# EAGLE board MOD-v2-2.1 (EAGLE 8.3.1)
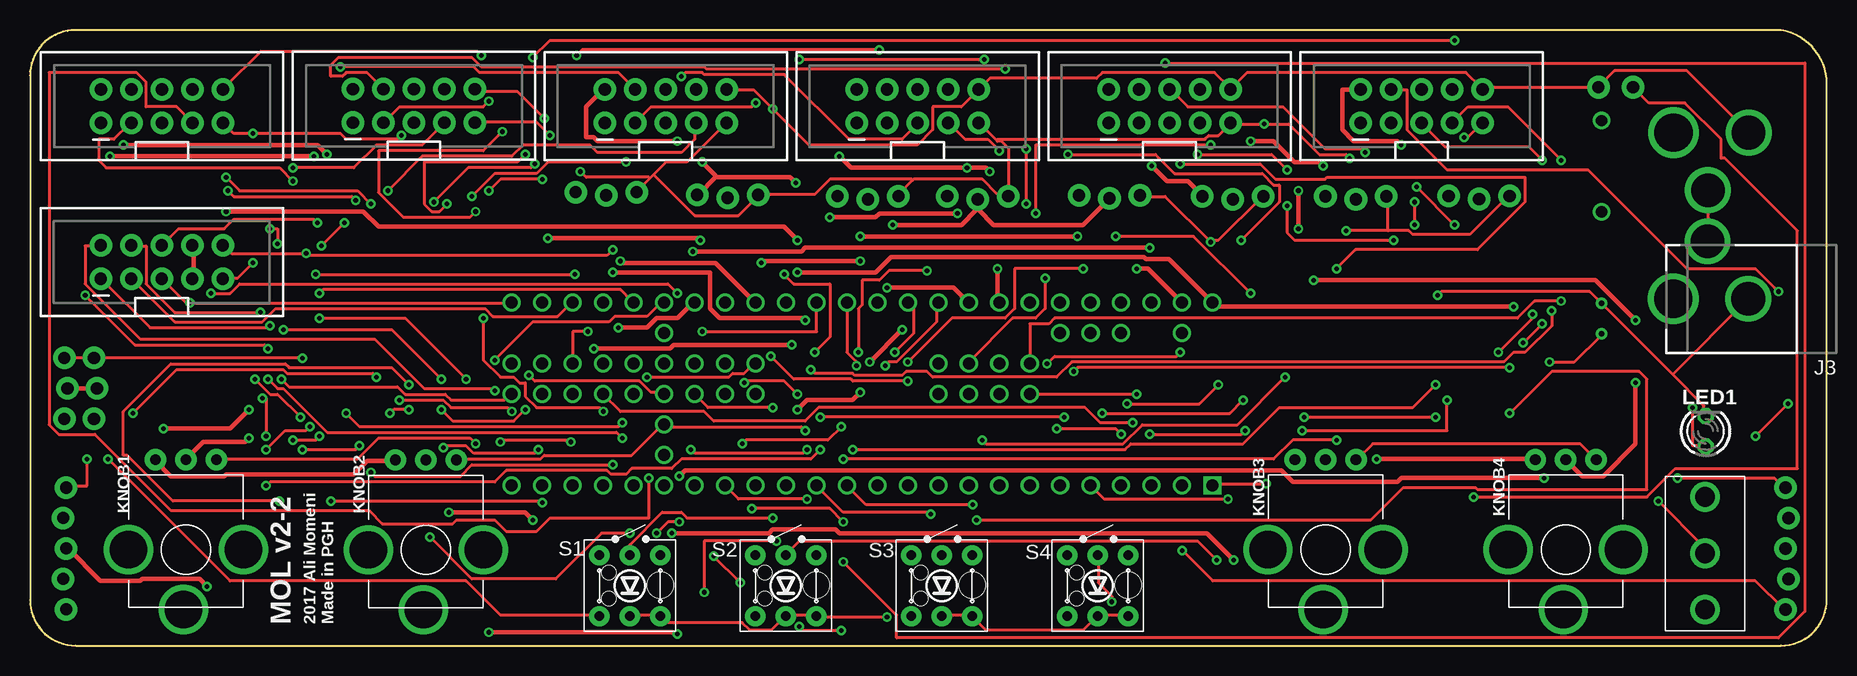
[diagram p2: board, top side]
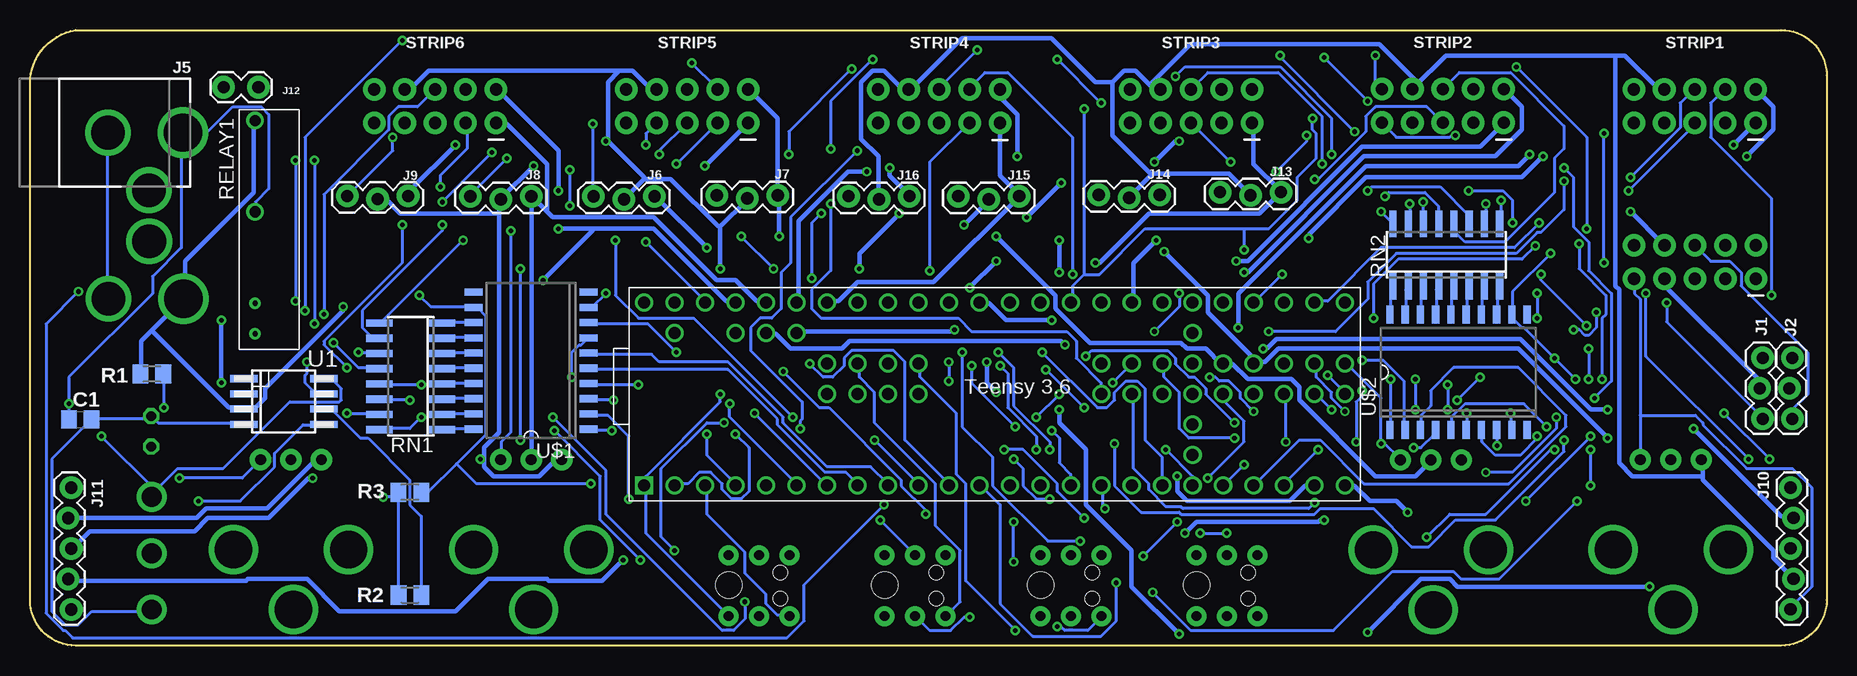
[diagram p3: board, bottom side, seen from below]

Size 149.77 x 51.34 mm. Coordinates in mm from the lower left corner, seen from the top.
Outline: 3.81,51.34 arc90 0,47.53 0,3.81 arc90 3.81,0 145.96,0 arc90 149.77,3.81 149.77,47.26 arc74 145.96,51.34 3.81,51.34
Copper layers (1*16): Top 0.035559375mm / dielectric 1.501140625mm / Bottom 0.035559375mm
Design rules "typical_4pcb *": minimum track width 10mil, minimum drill 15mil, track to track 6mil, track to pad 6mil, pad to pad 6mil, via to via 10mil, smd to smd 6mil, copper to edge 15mil, drill to drill 8mil, minimum pad ring 10mil, minimum via ring 8mil, stop-mask expansion 4mil, vias tented up to drill 0mil, thermal gap 10mil
Net classes: 2 Power: width 0.381 mm, clearance 0.279 mm; 3 Analog Sig: width 0.381 mm, clearance 0.279 mm

## Footprints (pad centres in the part's own frame; a part is rotated, then mirrored left to right if it is on the bottom)
C0805 = smd 1.3 x 1.5: 1 -0.95,0; 2 0.95,0
1X03_LOCK@1 = drill 1.016 pad 1.88: 1 0,0.127; 2 2.54,-0.127; 3 5.08,0.127
DCJACK_2MM_PTH = drill 2.8: GND 0,7.35; GNDBREAK 4.8,10.75 | drill 3.2: PWR 0,13.6
2X5-SHROUDED_LOCK = drill 1.016 pad 1.88: 1 -1.397,5.08; 2 1.397,5.08; 3 -1.397,2.54; 4 1.397,2.54; 5 -1.397,0; 6 1.397,0; 7 -1.397,-2.54; 8 1.397,-2.54; 9 -1.397,-5.08; 10 1.397,-5.08
1X03_LOCK = drill 1.016 pad 1.88: 1 0,0.127; 2 2.54,-0.127; 3 5.08,0.127
1X05_LOCK = drill 1.016 pad 1.88: 1 0,0.127; 2 2.54,-0.127; 3 5.08,0.127; 4 7.62,-0.127; 5 10.16,0.127
1X02_LOCK = drill 1.016 pad 1.88: 1 -0.178,0; 2 2.718,0
TRIM-PCB-9MM = drill 0.9 pad 1.778: 1 -2.54,-7.5; 2 0,-7.5; 3 2.54,-7.5 | drill 3.1 pad 4: M1 -4.8,0; M2 4.8,0; M3 0.2,5
LED3MM = drill 0.813 octagon: A -1.27,0; K 1.27,0
M0805 = smd 1.3 x 1.6: 1 -0.95,0; 2 0.95,0
G6DN-1A = drill 0.45: 1 0,0; 2 2.54,0 | drill 0.95: 5 10.16,0; 8 17.78,0
SO16 = smd 0.6 x 2.2: 1 -4.445,-2.6; 2 -3.175,-2.6; 3 -1.905,-2.6; 4 -0.635,-2.6; 5 0.635,-2.6; 6 1.905,-2.6; 7 3.175,-2.6; 8 4.445,-2.6; 9 4.445,2.6; 10 3.175,2.6; 11 1.905,2.6; 12 0.635,2.6; 13 -0.635,2.6; 14 -1.905,2.6; 15 -3.175,2.6; 16 -4.445,2.6
SWITCH_TR2-MOMENTARY-LED = drill 0.8 pad 1.676: 1 2.54,-2.54; 2 2.54,2.54; 3 -2.54,-2.54; 4 -2.54,2.54; A 0,2.54; C 0,-2.54 | hole 2.2: 2.53,0.05 | hole 1.2: -1.76,1.1; -1.76,-1.09
SWITCH_SPDT_500SSP1S2M2QEA = drill 1.65: 1 -4.7,0; 2 0,0; 3 4.7,0
TEENSY3-6_NO-USB-HOST = drill 1: 0 3.81,1.27; 1 6.35,1.27; 2 8.89,1.27; 3 11.43,1.27; 3V3(1) 36.83,1.27; 3V3(2) 46.99,6.35; 3V3(3) 6.35,16.51; 3V3(4) 59.69,11.43; 4 13.97,1.27; 5 16.51,1.27; 6 19.05,1.27; 7 21.59,1.27; 8 24.13,1.27; 9 26.67,1.27; 10 29.21,1.27; 11 31.75,1.27; 12 34.29,1.27; 13 34.29,16.51; 14 31.75,16.51; 15 29.21,16.51; 16 26.67,16.51; 17 24.13,16.51; 18 21.59,16.51; 19 19.05,16.51; 20 16.51,16.51; 21 13.97,16.51; 22 11.43,16.51; 23 8.89,16.51; 24 39.37,1.27; 25 41.91,1.27; 26 44.45,1.27; 27 46.99,1.27; 28 49.53,1.27; 29 52.07,1.27; 30 54.61,1.27; 31 57.15,1.27; 32 59.69,1.27; 33 59.69,16.51; 34 57.15,16.51; 35 54.61,16.51; 36 52.07,16.51; 37 49.53,16.51; 38 46.99,16.51; 39 44.45,16.51; 40 39.37,8.89; 41 41.91,8.89; 42 44.45,8.89; 43 49.53,8.89; 44 52.07,8.89; 45 54.61,8.89; 46 57.15,8.89; 47 57.15,11.43; 48 54.61,11.43; 49 52.07,11.43; 50 49.53,11.43; 51 44.45,11.43; 52 41.91,11.43; 53 39.37,11.43; 54 24.13,11.43; 55 21.59,11.43; 56 19.05,11.43; 57 16.51,11.43; A10 11.43,13.97; A11 13.97,13.97; AGND 3.81,16.51; AREF 8.89,13.97; DAC0 41.91,16.51; DAC1 39.37,16.51; DC 21.59,8.89; DD 24.13,8.89; DE 19.05,8.89; G1 46.99,8.89; G2 36.83,16.51; G3 59.69,8.89; G6 16.51,8.89; P 46.99,11.43; R 46.99,13.97; VBAT 46.99,3.81; VIN 1.27,16.51; VUSB 3.81,13.97 | drill 1 square: G0 1.27,1.27
ATTINY85 = smd 0.6 x 2.286: 1 -1.905,-3.33; 2 -0.635,-3.33; 3 0.635,-3.33; 4 1.905,-3.33; 5 1.905,3.33; 6 0.635,3.33; 7 -0.635,3.33; 8 -1.905,3.33
SOIC20 = smd 0.6 x 1.5: 1 -5.715,-4.8; 2 -4.445,-4.8; 3 -3.175,-4.8; 4 -1.905,-4.8; 5 -0.635,-4.8; 6 0.635,-4.8; 7 1.905,-4.8; 8 3.175,-4.8; 9 4.445,-4.8; 10 5.715,-4.8; 11 5.715,4.8; 12 4.445,4.8; 13 3.175,4.8; 14 1.905,4.8; 15 0.635,4.8; 16 -0.635,4.8; 17 -1.905,4.8; 18 -3.175,4.8; 19 -4.445,4.8; 20 -5.715,4.8

## Placement (x,y rotation side)
C1  10uF  [C0805]  145.58,18.85 0 bottom
J1  SERVO1  [1X03_LOCK@1]  5.46,23.99 270 bottom
J2  SERVO2  [1X03_LOCK@1]  2.99,23.99 270 bottom
J3  RPi  [DCJACK_2MM_PTH]  150.58,28.92 90 top
J4  ACTUATORS  [2X5-SHROUDED_LOCK]  10.99,31.99 90 top
J5  Battery  [DCJACK_2MM_PTH]  150.61,42.77 270 bottom
J6  AN5  [1X03_LOCK]  102.8,37.34 0 bottom
J7  AN6  [1X03_LOCK]  92.52,37.42 0 bottom
J8  AN7  [1X03_LOCK]  113.06,37.34 0 bottom
J9  AN8  [1X03_LOCK]  123.33,37.36 0 bottom
J10  JOY1  [1X05_LOCK]  2.89,3.02 90 bottom
J11  JOY2  [1X05_LOCK]  146.46,13.17 270 bottom
J12  RPi-Shutdown  [1X02_LOCK]  133.45,46.57 0 bottom
J13  AN5  [1X03_LOCK]  50.57,37.68 0 bottom
J14  AN6  [1X03_LOCK]  60.69,37.46 0 bottom
J15  AN7  [1X03_LOCK]  72.39,37.35 0 bottom
J16  AN8  [1X03_LOCK]  81.54,37.35 0 bottom
KNOB1  [TRIM-PCB-9MM]  13,8 180 top
KNOB2  [TRIM-PCB-9MM]  33,7.99 180 top
KNOB3  [TRIM-PCB-9MM]  107.99,8.01 180 top
KNOB4  [TRIM-PCB-9MM]  128.01,8 180 top
LED1  [LED3MM]  139.67,17.87 90 top
R1  330  [M0805]  139.62,22.65 0 bottom
R2  2.2K  [M0805]  118.09,4.21 180 bottom
R3  3.3K  [M0805]  118.1,12.79 0 bottom
RELAY1  RELAY-OMRON-G6DN  [G6DN-1A]  131,26 90 bottom
RN1  [SO16]  118.03,22.46 90 bottom
RN2  [SO16]  31.71,32.58 0 bottom
S1  SW-LEDPTH  [SWITCH_TR2-MOMENTARY-LED]  50,5 0 top
S2  SW-LEDPTH  [SWITCH_TR2-MOMENTARY-LED]  63,5 0 top
S3  SW-LEDPTH  [SWITCH_TR2-MOMENTARY-LED]  76,5 0 top
S4  SW-LEDPTH  [SWITCH_TR2-MOMENTARY-LED]  89,5 0 top
STRIP1  [2X5-SHROUDED_LOCK]  11,44.99 90 top
STRIP2  [2X5-SHROUDED_LOCK]  32,45.01 90 top
STRIP3  [2X5-SHROUDED_LOCK]  52.99,44.99 90 top
STRIP4  [2X5-SHROUDED_LOCK]  73.99,44.98 90 top
STRIP5  [2X5-SHROUDED_LOCK]  94.99,44.99 90 top
STRIP6  [2X5-SHROUDED_LOCK]  116,44.99 90 top
SW2  500SSP1S2M2QEA  [SWITCH_SPDT_500SSP1S2M2QEA]  139.62,7.7 270 top
TEENSY  TEENSY3_6-ALI_NO-USB-HOST  [TEENSY3-6_NO-USB-HOST]  99.84,12.09 0 bottom
U1  ATTINY85  [ATTINY85]  128.61,20.36 270 bottom
U$1  A2982  [SOIC20]  108,23.76 90 bottom
U$2  A2982  [SOIC20]  30.7,22.8 0 bottom

## Tracks (layer width: path | path; a pad name or v marks a point on that pad's centre or on a via)
+3V3  (via drill 0.38)
  Top 0.254: KNOB2.1 35.56,15.56 42.55,15.56 42.86,15.88 50.16,15.88 52.7,18.41 TEENSY.3V3(2) 52.7,18.26 64.29,18.26 v64.61,17.94 | v30.96,42.55 30.64,42.23 26.35,42.23 25.88,42.7 v18.57,42.7 16.99,42.7 16.19,43.5 STRIP1.9 | v18.57,31.91 17.3,30.64 16.19,30.64 J4.9 | v37.15,16.83 36.67,17.3 29.05,17.3 27.3,15.56 15.56,15.56 KNOB1.1 | KNOB3.1 110.65,15.56 111.92,16.83 129.22,16.83 130.49,15.56 KNOB4.1 | v137.32,13.97 145.41,13.97 146.21,13.18 J11.1 | J7.1 92.55,37.47 94.61,37.47 v98.42,33.66 98.42,33.81 99.06,33.81 102.71,37.47 J6.1 | 113.19,34.61 113.19,37.47 J8.1 | 113.19,34.61 114.94,34.61 115.25,34.29 120.02,34.29 123.19,37.47 J9.1 | v119.54,42.39 119.86,42.39 120.97,43.5 STRIP6.9 | 51.99,39.29 53.02,40.32 54.77,40.32 57.94,43.5 STRIP3.9 | 51.99,39.29 51.67,38.97 | 51.67,38.97 50.64,37.94 J13.1 | 51.99,39.29 55.4,35.88 59.05,35.88 60.64,37.47 J14.1 60.8,37.62 65.41,37.62 66.67,38.89 73.5,38.89 73.58,38.81 | 73.58,38.81 73.66,38.89 79.38,38.89 80.64,37.62 81.44,37.62 J16.1 81.6,37.62 81.6,41.43 80.96,42.07 80.64,42.07 80.57,42.15 | 73.58,38.81 72.39,37.62 J15.1 | 80.57,42.15 79.22,43.5 STRIP4.9 | 80.57,42.15 80.64,42.23 97.95,42.23 98.27,42.55 99.06,42.55 100.01,43.5 STRIP5.9 100.17,43.5 v102.87,43.5 104.93,43.5 107.47,40.96 109.7,40.96 v110.01,40.64 | 113.19,34.61 v109.7,34.61 | v43.34,42.55 42.23,43.66 37.15,43.66 STRIP2.9 | v45.88,39.53 46.35,39.05 51.59,39.05 51.67,38.97
  Bottom 0.254: 36.91,16.91 35.56,15.56 KNOB2.1 | 36.91,16.91 37.15,17.14 37.15,20.64 40.01,23.5 TEENSY.3V3(4) | v64.61,17.94 63.98,17.3 63.98,15.24 63.02,14.29 63.02,13.49 TEENSY.3V3(1) | v30.96,42.55 31.27,42.55 31.43,42.39 35.88,42.39 36.99,43.5 STRIP2.9 | 15.56,19.21 15.56,28.89 16.03,29.37 16.03,30.48 J4.9 | 15.56,19.21 15.56,15.56 KNOB1.1 | 15.56,19.21 10.95,19.21 10.32,18.57 10.32,18.41 6.67,14.76 2.86,14.76 1.27,13.18 1.27,4.92 3.02,3.17 J10.1 | v18.57,31.91 v18.57,42.7 | v37.15,16.83 36.99,16.83 36.91,16.91 | v137.32,13.97 132.08,13.97 130.65,15.4 KNOB4.1 | v98.42,33.66 93.5,28.73 TEENSY.3V3(3) | v119.54,42.39 119.54,41.27 123.19,37.62 J9.1 | v110.01,40.64 113.03,37.62 J8.1 | v102.87,43.5 102.87,37.62 J6.1 | v109.7,34.61 109.7,17.78 110.49,16.99 110.49,15.56 KNOB3.1 | v43.34,42.55 43.34,42.07 v45.88,39.53
+5V  (via drill 0.38)
  Top 0.381: J2.2 3.17,21.43 5.56,21.43 J1.2 | J4.7 13.65,30.64 13.65,33.34 J4.8 | v123.67,28.26 98.9,28.26 98.58,28.57 TEENSY.VIN 98.42,28.73 94.93,32.23 93.03,32.23 92.87,32.38 71.75,32.38 70.48,31.11 v63.98,31.11 | v16.35,36.2 27.78,36.2 29.05,34.92 62.87,34.92 v63.98,33.81
  Bottom 0.381: J1.2 5.71,21.59 5.71,22.23 13.49,30 13.49,30.48 J4.7 | 139.62,26.27 137,28.89 J3.PWR 136.84,29.05 136.84,32.07 131.13,37.78 131.13,43.66 RELAY1.8 | 139.62,26.27 140.49,25.4 140.49,22.7 R1.1 | 139.62,26.27 133.19,19.84 132.08,19.84 U1.3 131.76,19.68 131.13,19.68 130.18,20.64 130.18,21.43 123.67,27.94 v123.67,28.26 | v16.35,36.2 13.65,33.5 J4.8 | v63.98,31.11 v63.98,33.81
+5V-BATTERY  (via drill 0.38)
  Top 0.254: v146.53,20.16 v143.83,17.46
  Bottom 0.254: U1.8 125.25,22.23 124.62,22.23 123.83,21.43 123.83,20.48 123.98,20.32 128.11,20.32 133.67,14.76 137.48,14.76 139.7,12.54 SW2.1 139.38,13.02 v143.83,17.46 | 137.16,40.64 137.16,42.7 J5.PWR | 137.16,40.64 137.16,33.18 139.54,30.8 139.54,29.37 146.53,22.38 v146.53,20.16 146.53,18.89 C1.1 | 137.16,40.64 132.87,44.93 130.49,44.93 129.86,44.29 129.86,38.1 130.97,36.99 130.97,36.2 RELAY1.5
AGND  (via drill 0.38)
  Top 0.381: v112.24,15.56 125.41,15.56 KNOB4.3 | KNOB2.3 30.32,15.4 28.1,15.4 26.99,14.29 16.35,14.29 16.19,14.13 11.75,14.13 10.48,15.4 KNOB1.3 | v71.91,35.08 77.63,35.08 78.9,36.35 78.9,37.15 J16.2 79.06,36.35 80.33,35.08 87.79,35.08 89.85,37.15 J7.2 | v92.23,31.43 93.19,31.43 95.89,28.73 TEENSY.AGND | v107.79,40.01 107.47,40.32 105.41,40.32 103.66,42.07 v101.76,42.07
  Bottom 0.381: KNOB4.3 125.57,15.4 126.05,15.4 130.02,11.43 135.1,11.43 135.89,10.64 146.53,10.64 J11.2 | 111.92,15.56 111.92,16.51 110.65,17.78 110.65,36.04 | 111.92,15.56 111.92,14.92 111.12,14.13 107.31,14.13 106.05,15.4 105.57,15.4 KNOB3.3 | 110.65,36.04 110.65,37.15 J8.2 110.49,37.31 v107.79,40.01 | 110.65,36.04 118.9,36.04 120.02,37.15 120.65,37.15 J9.2 | v112.24,15.56 111.92,15.56 | 10.32,14.13 10.32,13.81 4.45,7.94 4.45,7.3 2.86,5.71 J10.2 | 10.32,14.13 10.32,15.4 KNOB1.3 | 17.62,49.21 31.75,49.21 34.45,46.51 STRIP2.8 34.13,46.99 37.31,50.16 53.02,50.16 56.36,46.83 STRIP3.8 55.56,46.51 56.2,46.51 57.63,47.94 58.58,47.94 59.53,46.99 | 17.62,49.21 16.83,49.21 14.13,46.51 13.65,46.51 STRIP1.8 | 56.2,39.37 49.85,39.37 48.1,37.62 J13.2 | 56.2,39.37 58.1,37.47 J14.2 | 59.53,46.99 59.53,42.55 56.36,39.37 56.2,39.37 | v71.91,35.08 69.85,37.15 J15.2 | J16.2 79.06,37.31 79.06,40.8 80.49,42.23 80.49,46.99 79.53,47.94 78.58,47.94 77.15,46.51 76.68,46.51 STRIP4.8 76.36,46.35 72.07,50.64 64.61,50.64 60.96,46.99 59.53,46.99 | 92.23,34.92 v92.23,31.43 | 92.23,34.92 90.01,37.15 J7.2 | 98.58,38.89 100.17,37.31 J6.2 | 98.58,38.89 96.36,38.89 92.39,34.92 92.23,34.92 | 100.65,47.94 99.54,47.94 98.11,46.51 97.63,46.51 STRIP5.8 | 100.65,47.94 101.6,46.99 101.6,42.07 | 101.6,42.07 98.58,39.05 98.58,38.89 | 100.65,47.94 116.52,47.94 117.95,46.51 118.43,46.51 STRIP6.8 | 10.32,14.13 16.19,14.13 17.3,15.24 17.3,29.69 17.62,30 17.62,49.21 | v101.76,42.07 101.6,42.07
AN1  (via drill 0.38)
  Top 0.381: v49.05,26.51 51.44,26.51 52.23,27.3 53.98,27.3 55.24,28.57 TEENSY.39 | v24.77,40.96 23.97,41.75 v7.78,41.75
  Bottom 0.381: v49.05,26.51 49.05,29.37 38.42,40.01 25.72,40.01 v24.77,40.96 | v7.78,41.75 6.03,43.5 STRIP1.1
AN2  (via drill 0.38)
  Top 0.381: v55.88,33.81 55.72,33.97 v43.18,33.97 | v6.67,40.8 v23.65,40.8
  Bottom 0.381: v55.88,33.81 57.78,31.91 57.78,28.73 TEENSY.DAC0 | v43.18,33.97 43.18,34.29 38.42,39.05 25.4,39.05 v23.65,40.8 | v6.67,40.8 4.45,43.02 4.45,44.93 5.87,46.35 STRIP1.2
AN3  (via drill 0.38)
  Top 0.381: v49.21,32.07 49.37,31.91 57.15,31.91 60.33,28.73 TEENSY.DAC1
  Bottom 0.381: v49.21,32.07 48.26,32.07 38.73,41.59 28.89,41.59 26.99,43.5 STRIP2.1
AN4  (via drill 0.38)
  Top 0.381: v64.61,27.15 64.45,27.3 57.47,27.3 56.67,28.1 56.67,31.11 v48.58,31.11
  Bottom 0.381: v64.61,27.15 68.42,27.15 69.85,28.57 70.48,28.57 TEENSY.15 | v48.58,31.11 48.26,31.11 38.58,40.8 27.62,40.8 25.4,43.02 25.4,44.93 26.83,46.35 STRIP2.2
AN5  (via drill 0.38)
  Top 0.381: v71.44,29.84 76.99,29.84 78.11,28.73 TEENSY.18 | v69.22,32.07 61.12,32.07 v60.96,31.91
  Bottom 0.381: v69.22,32.07 v71.44,29.84 | v60.96,31.91 60.64,31.91 56.52,36.04 47.31,36.04 45.56,37.78 J13.3 45.56,37.94 47.78,40.16 47.78,43.5 STRIP3.1
AN6  (via drill 0.38)
  Top 0.381: v80.64,31.43 80.64,28.73 TEENSY.19 | v77.31,36.04 70.8,36.04 70.48,35.72 v66.67,35.72 | v63.82,38.58 63.34,39.05 57.15,39.05 | 57.15,39.05 55.72,37.62 J14.3 | v53.98,42.07 47.31,42.07 46.99,42.39 46.35,42.39 46.35,44.93 47.78,46.35 STRIP3.2 | v56.04,40.32 57.15,39.21 57.15,39.05
  Bottom 0.381: v80.64,31.43 80.64,32.7 v77.31,36.04 | v63.82,38.58 v66.67,35.72 | v53.98,42.07 54.29,42.07 v56.04,40.32
AN7
  Bottom 0.381: TEENSY.20 83.19,28.73 82.39,28.73 80.8,30.32 74.45,30.32 67.31,37.47 J15.3 67.31,37.62 68.9,39.21 68.9,43.5 STRIP4.1
AN8  (via drill 0.38)
  Top 0.381: v80.01,39.53 79.69,39.85 v78.11,39.85 68.42,39.85 v67.47,40.8
  Bottom 0.381: v80.01,39.53 81.6,39.53 85.72,35.4 85.72,28.73 TEENSY.21 | v78.11,39.85 78.11,39.21 76.52,37.62 J16.3 | v67.47,40.8 67.47,44.29 68.9,45.72 68.9,46.35 STRIP4.2
AN9  (via drill 0.38)
  Top 0.381: v93.5,40.01 94.77,38.73 96.52,38.73 97.63,37.62 J6.3 | v18.26,17.3 17.94,16.99 14.45,16.99 13.02,15.56 KNOB1.2 | v93.34,33.18 64.61,33.18 64.29,32.86 v55.24,32.86
  Bottom 0.381: v93.5,40.01 90.01,43.5 STRIP5.1 | v18.26,17.3 25.72,24.77 45.72,24.77 46.83,23.65 47.62,23.65 TEENSY.49 47.62,23.81 51.59,27.78 51.59,29.21 v55.24,32.86 | v93.34,33.18 97.63,37.47 J6.3
AN10  (via drill 0.38)
  Top 0.381: v69.22,34.13 v87.31,34.13
  Bottom 0.381: STRIP5.2 89.85,46.35 87.47,43.97 87.47,37.62 J7.3 87.31,37.47 v87.31,34.13 | KNOB2.2 33.02,15.4 34.29,14.13 37.62,14.13 43.97,20.48 43.97,21.59 44.61,22.23 48.26,22.23 49.53,23.5 50.16,23.5 TEENSY.50 50.48,23.5 51.75,24.77 53.34,24.77 53.82,25.24 61.44,25.24 64.29,28.1 64.29,29.21 v69.22,34.13
AN11
  Bottom 0.381: 106.76,36.27 107.95,37.47 J8.3 107.95,37.31 107.95,15.56 KNOB3.2 | 106.76,36.27 106.2,35.72 97.79,35.72 92.55,30.48 90.96,30.48 89.22,28.73 88.42,28.73 TEENSY.22 | STRIP6.1 110.81,43.5 110.01,43.5 106.68,40.16 106.68,36.35 106.76,36.27
AN12  (via drill 0.38)
  Top 0.381: v105.73,37.94 v105.73,34.77 | v133.83,21.91 133.83,16.83 131.13,14.13 129.38,14.13 128.11,15.4 KNOB4.2 | v133.83,27.15 130.49,30.48 v107,30.48 | v114.3,41.75 113.98,42.07 110.33,42.07 109.38,43.02 109.38,46.35 110.81,46.35 STRIP6.2
  Bottom 0.381: v105.73,34.77 102.87,34.77 | 102.87,34.77 97.79,34.77 91.76,28.73 90.96,28.73 TEENSY.23 | v105.73,37.94 105.73,41.27 110.81,46.35 STRIP6.2 | v133.83,27.15 v133.83,21.91 | v107,30.48 102.87,34.61 102.87,34.77 | v114.3,41.75 118.11,37.94 118.11,37.62 J9.3
B1  (via drill 0.38)
  Top 0.254: v46.51,26.19 45.24,26.19 45.24,23.65 TEENSY.48 | v21.91,38.73 20.8,39.85 6.35,39.85 5.71,40.48 5.71,42.23 6.99,42.23 8.26,43.5 8.41,43.5 STRIP1.3
  Bottom 0.254: v46.51,26.19 40.96,26.19 38.26,28.89 38.26,30.32 35.88,32.7 25.88,32.7 24.13,34.45 23.81,34.45 21.91,36.35 v21.91,38.73
B2  (via drill 0.38)
  Top 0.254: v49.37,17.3 48.9,17.78 24.77,17.78 21.11,21.43 20.64,21.43 v19.84,22.23 | v19.84,24.77 19.53,25.08 8.73,25.08 v4.6,29.21
  Bottom 0.254: v49.37,17.3 53.18,17.3 53.98,18.1 53.98,21.11 55.24,22.38 55.24,23.5 TEENSY.51 | v19.84,24.77 v19.84,22.23 | v4.6,29.21 4.6,37.31 9.68,42.39 9.68,45.24 8.57,46.35 STRIP1.4
B3  (via drill 0.38)
  Top 0.254: v61.91,19.84 56.52,19.84 55.4,20.95 TEENSY.42 | v65.09,23.02 65.41,22.7 68.58,22.7 68.74,22.54 72.71,22.54 73.03,22.86 74.77,22.86 75.25,22.38 85.57,22.38 86.84,23.65 122.87,23.65 123.67,24.45 124.62,24.45 126.84,26.67 v126.84,27.94 | v118.75,50.48 43.34,50.48 v41.91,49.05 | v38.26,45.4 37.78,44.93 30.8,44.93 29.53,43.66 STRIP2.3
  Bottom 0.254: v65.09,23.02 v61.91,19.84 | v126.84,27.94 126.84,42.39 v118.75,50.48 | v38.26,45.4 v41.91,49.05
B4  (via drill 0.38)
  Top 0.254: v59.53,21.91 59.69,22.07 62.87,22.07 v63.98,20.95 | v86.2,19.05 v65.88,19.05 | v100.97,33.81 104.14,36.99 104.14,38.42 103.66,38.42 102.71,39.37 95.41,39.37 93.82,40.96 v86.52,40.96 | v81.28,48.1 56.36,48.1 56.2,48.26 37.62,48.26 36.83,49.05 25.72,49.05 25.08,48.42 25.08,47.47 26.04,47.47 26.35,47.78 28.1,47.78 29.37,46.51 STRIP2.4
  Bottom 0.254: v59.53,21.91 57.94,23.5 TEENSY.52 | v65.88,19.05 v63.98,20.95 | v86.2,19.05 94.46,27.3 99.06,27.3 100.97,29.21 v100.97,33.81 | v86.52,40.96 86.52,42.86 v81.28,48.1
B5  (via drill 0.38)
  Top 0.254: v83.03,41.43 v83.03,36.83 | v64.14,48.9 v79.53,48.9 | v60.48,45.24 60.17,44.93 51.75,44.93 50.48,43.66 STRIP3.3
  Bottom 0.254: v83.03,36.83 83.03,31.27 84.61,29.69 84.61,28.1 83.82,27.3 72.39,27.3 71.28,26.19 63.34,26.19 62.55,25.4 62.55,23.97 60.48,21.91 60.48,21.11 TEENSY.40 | v83.03,41.43 83.03,45.4 v79.53,48.9 | v60.48,45.24 v64.14,48.9
B6  (via drill 0.38)
  Top 0.254: v48.58,15.08 36.83,15.08 35.88,14.13 28.73,14.13 v28.42,14.45 | v22.54,19.05 20.64,20.95 20,20.95 v18.73,22.23 | v20.64,33.5 20.64,34.77 v20,34.77 | v25.88,48.26 36.99,48.26 37.47,47.78 49.05,47.78 50.32,46.51 STRIP3.4
  Bottom 0.254: v48.58,15.08 50.16,13.49 TEENSY.28 | v28.42,14.45 26.19,14.45 22.54,18.1 v22.54,19.05 | v18.73,22.23 18.73,27.3 18.41,27.62 18.41,29.21 20.64,31.43 v20.64,33.5 | v20,34.77 20,42.39 v25.88,48.26
B7  (via drill 0.38)
  Top 0.254: v55.09,16.35 55.4,16.03 64.45,16.03 v64.77,16.35 | v69.06,24.45 69.06,28.1 69.37,28.42 69.37,30.48 70.8,30.48 71.6,31.27 v74.77,31.27
  Bottom 0.254: v55.09,16.35 52.86,14.13 52.86,13.49 TEENSY.27 | v64.77,16.35 64.77,16.99 67.79,20 67.79,23.18 v69.06,24.45 | v74.77,31.27 74.77,40.32 71.6,43.5 STRIP4.3
B8  (via drill 0.38)
  Top 0.254: v65.41,24.45 66.67,25.72 66.67,30.16 63.66,30.16 v62.87,30.96
  Bottom 0.254: v65.41,24.45 60.8,19.84 60.01,19.84 59.37,20.48 59.37,21.11 58.42,22.07 57.47,22.07 56.83,21.43 56.83,17.14 55.4,15.72 55.4,13.49 TEENSY.26 | v62.87,30.96 62.87,42.39 68.26,47.78 70.17,47.78 71.44,46.51 STRIP4.4
B9  (via drill 0.38)
  Top 0.254: v64.77,12.22 59.05,12.22 57.94,13.34 TEENSY.25 | v67.79,15.56 103.66,15.56 105.25,17.14 v108.9,17.14 | v108.9,31.43 110.49,33.02 120.65,33.02 124.62,36.99 124.62,39.05 108.11,39.05 107.95,38.89 103.82,38.89 102.55,40.16 v95.89,40.16
  Bottom 0.254: v64.77,12.22 65.88,12.22 66.99,13.34 66.99,14.76 v67.79,15.56 | v108.9,31.43 v108.9,17.14 | v95.89,40.16 92.55,43.5 STRIP5.3
B10  (via drill 0.38)
  Top 0.254: v60.17,11.43 66.67,11.43 v67.79,10.32 | v67.79,6.99 72.23,2.54 72.23,0.64 145.73,0.64 147.96,2.86 147.96,48.58 v94.61,48.58
  Bottom 0.254: v60.17,11.43 60.33,11.59 60.33,13.34 TEENSY.24 | v67.79,6.99 v67.79,10.32 | v94.61,48.58 92.55,46.51 STRIP5.4
B11  (via drill 0.38)
  Top 0.254: v75.09,10.95 74.93,11.11 67.79,11.11 65.56,13.34 TEENSY.12 | v87,22.86 87.31,23.18 v123.35,23.18 | v115.57,38.26 v118.75,35.08
  Bottom 0.254: v75.09,10.95 75.09,11.27 77.15,13.34 77.15,13.81 83.19,19.84 83.98,19.84 v87,22.86 | v123.35,23.18 125.25,25.08 125.25,25.4 118.75,31.91 v118.75,35.08 | v115.57,38.26 115.57,39.21 113.35,41.43 113.35,43.5 STRIP6.3
B12  (via drill 0.38)
  Top 0.254: v78.58,11.75 69.69,11.75 68.1,13.34 TEENSY.11 | v145.73,29.53 143.83,31.43 138.11,31.43 129.86,39.69 118.11,39.69 114.78,43.02 114.78,46.35 113.51,46.35 STRIP6.4
  Bottom 0.254: v78.58,11.75 85.25,5.08 85.25,2.06 86.68,0.64 146.21,0.64 146.84,1.27 147,1.27 148.43,2.7 148.43,26.83 v145.73,29.53
B13  (via drill 0.38)
  Top 0.254: v56.04,26.19 65.56,26.19 65.56,28.57 TEENSY.13 | v53.98,29.37 53.18,30.16 17.46,30.16 16.67,29.37 v15.08,29.37 | v6.51,15.56 16.67,5.4 36.35,5.4 39.21,2.54 47.31,2.54 S1.3
  Bottom 0.254: v56.04,26.19 53.98,28.26 v53.98,29.37 | v15.08,29.37 15.08,24.13 v6.51,15.56
B14  (via drill 0.38)
  Top 0.254: v67.63,1.27 64.45,1.27 v64.14,1.59
  Bottom 0.254: v67.63,1.27 71.75,5.4 71.75,13.49 72.55,14.29 72.55,19.37 75.56,22.38 75.56,23.5 TEENSY.54 | v64.14,1.59 63.82,1.59 63.5,1.27 61.59,1.27 60.48,2.38 S2.3
B15
  Bottom 0.254: TEENSY.56 80.64,23.5 80.64,22.38 79.38,21.11 79.38,18.57 74.3,13.49 74.3,10 72.23,7.94 72.23,3.65 73.34,2.54 S3.3
B16
  Bottom 0.254: TEENSY.1 93.34,13.34 93.34,10.95 90.17,7.78 90.17,6.03 88.42,4.29 88.42,3.49 87.47,2.54 86.52,2.54 S4.3
GND  (via drill 0.38)
  Top 0.254: S1.C 50.01,2.54 52.39,2.54 S1.1 52.55,2.38 53.02,1.91 59.37,1.91 60.01,1.27 61.75,1.27 62.87,2.38 S2.C 63.02,2.54 65.41,2.54 S2.1 65.56,2.38 v71.44,2.38 | S3.C 76.04,2.54 78.42,2.54 S3.1 78.58,2.38 79.69,1.27 87.79,1.27 88.9,2.38 S4.C 89.06,2.54 91.44,2.54 S4.1 | v92.23,20.95 83.34,20.95 TEENSY.G6 | v103.03,13.49 98.58,13.49 TEENSY.G0 | v41.59,22.54 42.07,22.07 50.8,22.07 51.75,21.11 52.7,21.11 TEENSY.G1 | J2.1 3.02,23.97 5.24,23.97 J1.1 5.4,23.97 v22.7,23.97 | J4.10 16.19,33.34 16.83,32.7 v23.02,32.7 23.18,32.54 48.1,32.54 v48.58,33.02 | v20.95,22.23 21.59,21.59 30.64,21.59 31.27,20.95 34.61,20.95 35.08,20.48 39.53,20.48 40.01,20.95 TEENSY.G3 | v37.62,49.21 37.31,49.53 19.21,49.53 16.19,46.51 STRIP1.10 | STRIP3.10 58.1,46.35 60.33,46.35 v61.91,44.77 64.93,41.75 73.98,41.75 75.25,43.02 75.25,44.93 77.63,44.93 79.06,46.35 STRIP4.10 79.22,46.51 80.01,47.31 88.9,47.31 89.38,47.78 98.74,47.78 100.01,46.51 STRIP5.10 100.17,46.51 101.44,47.78 119.7,47.78 120.97,46.51 STRIP6.10 121.13,46.51 130.65,46.51 J12.2 130.81,46.67 132.08,47.94 138.11,47.94 143.19,42.86 J5.GND | v42.86,43.97 40.64,46.2 37.31,46.2 37.15,46.35 STRIP2.10 | 136.92,22.62 139.54,20 139.54,19.21 LED1.K | 136.92,22.62 131.13,28.42 RELAY1.2 130.97,28.57 130.02,29.53 117.63,29.53 v117.32,29.21 | 136.92,22.62 143.19,28.89 J3.GND
  Bottom 0.254: 114.22,15.16 116.52,12.86 117,12.86 R3.2 | 114.22,15.16 111.76,17.62 111.76,27.46 112.39,28.1 112.71,28.1 U$1.12 112.87,28.26 116.36,28.26 v117.32,29.21 | S4.1 91.6,2.54 98.42,9.37 98.42,13.34 TEENSY.G0 98.42,13.49 98.42,14.13 92.23,20.32 v92.23,20.95 | 114.22,15.16 112.55,13.49 v103.03,13.49 | v71.44,2.38 71.91,2.38 73.03,1.27 74.77,1.27 75.88,2.38 S3.C | v41.59,22.54 40.16,21.11 TEENSY.G3 | v23.02,32.7 26.19,29.53 26.19,27.62 U$2.12 26.35,27.46 25.4,26.51 25.24,26.51 v22.7,23.97 v20.95,22.23 | v37.62,49.21 37.62,46.99 37.15,46.51 STRIP2.10 | 61.91,30.96 62.87,30 62.87,28.73 TEENSY.G2 | v61.91,44.77 61.91,30.96 | v42.86,43.97 42.86,43.02 42.55,42.7 42.55,40.64 44.13,39.05 44.13,37.15 46.51,34.77 48.58,34.77 | 48.58,34.77 56.83,34.77 60.64,30.96 61.91,30.96 | 48.58,34.77 v48.58,33.02 | U1.4 132.08,18.57 139.06,18.57 139.54,19.05 LED1.K 139.7,19.05 139.86,18.89 144.62,18.89 C1.2 144.78,18.73 147.96,15.56 147.96,2.86 146.84,1.75 145.73,1.75 144.62,2.86 139.7,2.86 SW2.3 | J3.GND 143.35,29.05 143.35,42.7 J5.GND
GNDBREAK
  Top 0.254: J3.GNDBREAK 139.86,33.81 139.86,37.94 J5.GNDBREAK
JOYB1  (via drill 0.38)
  Top 0.254: v40.16,19.53 39.85,19.84 35.08,19.84 34.45,20.48 v30.8,20.48 | v28.89,22.38 28.57,22.7 21.43,22.7 21.11,23.02 12.22,23.02 v8.57,19.37 | v4.76,15.56 4.76,13.34 3.17,13.34 J10.5
  Bottom 0.254: v40.16,19.53 41.27,20.64 41.27,21.11 42.55,22.38 42.55,23.5 TEENSY.47 | v28.89,22.38 v30.8,20.48 | v4.76,15.56 v8.57,19.37
JOYB2  (via drill 0.38)
  Top 0.254: v91.92,18.57 89.22,18.57 87.95,19.84 65.72,19.84 64.61,18.73 56.99,18.73 56.2,19.53 49.21,19.53 47.78,20.95 TEENSY.44 | v96.04,7.94 98.58,5.4 143.83,5.4 146.21,3.02 J11.5
  Bottom 0.254: v91.92,18.57 93.34,18.57 97.16,14.76 97.16,9.05 v96.04,7.94
JOYH1  (via drill 0.38)
  Top 0.381: v70.01,23.65 v72.71,26.35 | v69.22,21.11 68.58,20.48 64.77,20.48 v63.98,19.68 | v53.98,0.95 53.82,1.11 v38.26,1.11 | v14.76,4.92 14.13,5.56 9.37,5.56 9.21,5.4 5.87,5.4 3.17,8.1 J10.3
  Bottom 0.381: v72.71,26.35 72.87,26.19 85.72,26.19 TEENSY.A11 | v70.01,23.65 70.01,21.91 v69.22,21.11 | v63.98,19.68 63.98,18.57 61.75,16.35 61.75,11.75 57.94,7.94 57.94,4.92 v53.98,0.95 | v38.26,1.11 33.81,5.56 31.43,5.56 30.8,4.92 v14.76,4.92
JOYH2  (via drill 0.38)
  Top 0.381: v54.13,14.13 54.61,14.61 104.3,14.61 105.25,13.65 113.98,13.65 114.3,13.97 v126.21,13.97
  Bottom 0.381: v54.13,14.13 54.13,12.86 53.34,12.06 44.77,12.06 43.5,13.34 42.7,13.34 TEENSY.31 | v126.21,13.97 126.52,13.97 129.86,10.64 134.94,10.64 136.05,9.53 144.78,9.53 146.21,8.1 J11.3
JOYV1  (via drill 0.38)
  Top 0.381: v63.5,25.08 53.66,25.08 53.34,24.77 v46.99,24.77 | v18.26,19.68 16.67,18.1 v11.11,18.1
  Bottom 0.381: v63.5,25.08 63.82,25.4 81.44,25.4 82.07,24.77 86.36,24.77 87.63,26.04 88.27,26.04 TEENSY.A10 | v46.99,24.77 46.67,24.77 45.88,25.56 25.56,25.56 19.68,19.68 v18.26,19.68 | v11.11,18.1 3.81,10.79 2.86,10.79 J10.4
JOYV2  (via drill 0.38)
  Top 0.381: v34.92,11.11 41.27,11.11 v41.91,10.48 | v53.5,9.37 61.59,9.37 61.91,9.68 67.15,9.68 67.47,9.37 98.11,9.37 v100.33,7.14
  Bottom 0.381: v34.92,11.11 35.88,12.06 38.1,12.06 39.37,13.34 40.01,13.34 TEENSY.32 | v41.91,10.48 42.23,10.48 42.39,10.32 52.55,10.32 v53.5,9.37 | v100.33,7.14 102.08,5.4 106.52,5.4 106.68,5.56 111.6,5.56 114.3,2.86 123.98,2.86 126.68,5.56 131.6,5.56 131.76,5.4 146.53,5.4 J11.4
LED1  (via drill 0.38)
  Top 0.254: v51.59,13.97 51.59,10.64 43.34,10.64 42.23,9.53 39.69,9.53 38.73,10.48 35.56,10.48 35.24,10.16 29.37,10.16 28.26,11.27 11.75,11.27 5.4,17.62 2.38,17.62 1.59,18.41 1.59,47.78 8.89,47.78 9.68,46.99 9.68,44.93 12.22,44.93 13.49,43.66 STRIP1.7
  Bottom 0.254: v51.59,13.97 48.58,16.99 48.58,18.73 50.16,20.32 50.16,20.95 TEENSY.43
LED2  (via drill 0.38)
  Top 0.254: v42.7,11.91 42.55,12.06 v25.08,12.06 | v19.68,17.46 19.68,20.64 v19.37,20.64 | v21.91,39.85 26.99,39.85 28.89,41.75 32.7,41.75 34.45,43.5 STRIP2.7
  Bottom 0.254: v42.7,11.91 43.18,11.43 53.66,11.43 53.82,11.59 55.09,11.59 56.52,13.02 56.52,13.49 57.78,14.76 57.78,20.95 TEENSY.41 | v19.68,17.46 v25.08,12.06 | v19.37,20.64 17.94,22.07 17.94,29.37 19.84,31.27 19.84,33.66 21.11,34.92 21.11,39.05 v21.91,39.85
LED3  (via drill 0.38)
  Top 0.254: v51.44,22.38 58.26,22.38 58.58,22.7 59.53,22.7 60.33,23.5 TEENSY.53 | v47.78,19.53 47.47,19.84 42.23,19.84 41.27,20.8 41.27,21.91 40.8,21.91 40.32,22.38 39.21,22.38 37.78,23.81 v37.78,27.3 | v26.19,35.24 v24.29,33.34 | v29.84,37.94 32.7,40.8 40.16,40.8 41.12,41.75 46.67,41.75 47.31,41.12 54.29,41.12 55.4,42.23 55.4,43.5 STRIP3.7
  Bottom 0.254: v51.44,22.38 50.96,22.38 50.64,22.07 49.85,22.07 48.9,21.11 48.9,20.64 v47.78,19.53 | v37.78,27.3 37.78,30.16 35.72,32.23 25.4,32.23 v24.29,33.34 | v26.19,35.24 26.19,37.15 26.99,37.94 v29.84,37.94
LED4  (via drill 0.38)
  Top 0.254: v90.96,17.62 90.49,18.1 v85.57,18.1 | v80.8,41.27 79.85,42.23 77.95,42.23 76.68,43.5 STRIP4.7
  Bottom 0.254: v90.96,17.62 89.85,16.51 89.85,12.86 90.49,12.22 91.28,12.22 92.08,13.02 92.08,13.49 93.03,14.45 93.98,14.45 94.93,13.49 95.89,13.49 TEENSY.0 | v85.57,18.1 85.57,18.73 85.41,18.89 85.41,20.32 89.69,24.61 89.69,26.51 88.9,27.3 87.95,27.3 87.15,28.1 87.15,31.11 86.36,31.91 86.36,35.72 v80.8,41.27
LED5  (via drill 0.38)
  Top 0.254: v84.61,30.64 84.61,28.1 83.82,27.3 81.92,27.3 78.26,23.65 TEENSY.55 | v83.82,36.04 83.82,41.75 v98.42,41.75
  Bottom 0.254: v84.61,30.64 84.61,35.24 v83.82,36.04 | v98.42,41.75 98.42,42.7 97.63,43.5 STRIP5.7
LED6  (via drill 0.38)
  Top 0.254: v127.64,28.73 125.41,28.73 123.98,27.3 85.41,27.3 84.93,26.83 83.34,26.83 83.34,23.65 TEENSY.57 | v127.64,40.48 123.19,44.93 119.86,44.93 118.59,43.66 STRIP6.7
  Bottom 0.254: v127.64,40.48 v127.64,28.73
M_INA  (via drill 0.38)
  Top 0.254: v45.09,16.99 44.93,17.14 39.37,17.14 v39.21,16.99 | v38.73,21.27 38.58,21.43 32.86,21.43 28.73,25.56 9.21,25.56 4.6,30.16 4.6,33.34 5.87,33.34 J4.2
  Bottom 0.254: v45.09,16.99 45.09,20.95 TEENSY.45 | v39.21,16.99 39.21,20.32 38.73,20.8 v38.73,21.27
M_INB  (via drill 0.38)
  Top 0.254: v41.27,19.68 40.32,18.73 35.24,18.73 v34.29,19.68 | v34.29,22.23 30.16,26.35 v21.11,26.35 | v19.21,27.78 12.06,27.78 9.68,30.16 9.68,33.34 8.57,33.34 J4.4
  Bottom 0.254: v41.27,19.68 42.55,20.95 TEENSY.46 | v34.29,22.23 v34.29,19.68 | v21.11,26.35 20.64,26.35 20.16,25.88 19.84,25.88 19.21,26.51 v19.21,27.78
M_PWMA  (via drill 0.38)
  Top 0.254: v23.81,30.96 v45.4,30.96 | v20,26.67 19.84,26.51 10,26.51 6.03,30.48 J4.1
  Bottom 0.254: v45.4,30.96 47.62,28.73 TEENSY.36 | v23.81,30.96 23.81,30.48 v20,26.67
M_PWMB
  Top 0.254: TEENSY.35 45.09,28.57 43.97,27.46 38.58,27.46 37.94,28.1 20.48,28.1 19.37,26.99 12.06,26.99 8.57,30.48 J4.3
N$2  (via drill 0.38)
  Top 0.254: v138.59,19.84 138.59,16.67 139.54,16.67 LED1.A
  Bottom 0.254: v138.59,19.84 138.59,22.54 R1.2
N$3  (via drill 0.38)
  Top 0.254: v135.73,12.06 139.54,8.26 139.54,7.78 SW2.2
  Bottom 0.254: v135.73,12.06 132.24,12.06 129.38,14.92 129.38,16.03 127,18.41 125.41,18.41 U1.5
N$4  (via drill 0.38)
  Top 0.254: v126.68,23.65 128.75,23.65 130.97,25.88 RELAY1.1
  Bottom 0.254: v126.68,23.65 126.68,22.7 126.84,22.54 126.84,21.91 126.05,21.11 125.41,21.11 U1.7
N$5  (via drill 0.38)
  Top 0.254: v120.33,12.38 134.78,12.38 137.16,14.76 147.32,14.76 147.32,34.61 141.29,40.64 140.97,40.64 140.97,42.23 137.95,45.24 134.94,45.24 133.67,46.51 J12.1
  Bottom 0.254: 119.06,12.38 119.06,12.7 R3.1 119.06,12.38 | 119.06,12.38 119.06,4.29 R2.2 | 119.06,12.38 v120.33,12.38
N$11
  Bottom 0.254: U$1.13 112.87,26.99 115.41,26.99 RN1.8
N$12
  Bottom 0.254: U$1.14 112.87,25.72 115.41,25.72 RN1.7
N$13
  Bottom 0.254: U$1.15 112.87,24.45 115.41,24.45 RN1.6
N$14
  Bottom 0.254: U$1.16 112.87,23.18 115.41,23.18 RN1.5
N$15
  Bottom 0.254: U$1.17 112.87,21.91 115.41,21.91 RN1.4
N$16
  Bottom 0.254: U$1.18 112.87,20.64 115.41,20.64 RN1.3
N$17
  Bottom 0.254: U$1.19 112.87,19.37 115.41,19.37 RN1.2
N$18
  Bottom 0.254: U$1.20 112.87,18.1 115.41,18.1 RN1.1
N$19
  Bottom 0.254: U$2.20 36.35,27.62 36.35,29.69 36.2,29.84 RN2.1
N$20
  Bottom 0.254: U$2.19 35.08,27.62 35.08,29.69 34.92,29.84 RN2.2
N$21
  Bottom 0.254: U$2.18 33.81,27.62 33.81,29.69 33.66,29.84 RN2.3
N$22
  Bottom 0.254: U$2.17 32.54,27.62 32.54,29.69 32.38,29.84 RN2.4
N$23
  Bottom 0.254: U$2.16 31.27,27.62 31.27,29.69 31.11,29.84 RN2.5
N$24
  Bottom 0.254: U$2.15 30,27.62 30,29.69 29.84,29.84 RN2.6
N$25
  Bottom 0.254: U$2.14 28.73,27.62 28.73,29.69 28.57,29.84 RN2.7
N$26
  Bottom 0.254: U$2.13 27.46,27.62 27.46,29.69 27.3,29.84 RN2.8
PI-REST
  Bottom 0.254: R2.1 117.16,4.29 117.16,10.79 118.11,11.75 118.11,13.81 121.6,17.3 122.24,17.3 124.62,19.68 125.25,19.68 U1.6
PWM1  (via drill 0.38)
  Top 0.254: v104.62,22.38 100.65,18.41 92.71,18.41 91.12,16.83 79.69,16.83 v79.38,17.14
  Bottom 0.254: v104.62,22.38 104.62,24.45 103.98,25.08 103.82,25.08 103.35,25.56 U$1.7 | v79.38,17.14 75.72,13.49 TEENSY.8
PWM2  (via drill 0.38)
  Top 0.254: v95.89,24.45 95.57,24.13 85.41,24.13 v84.77,23.5
  Bottom 0.254: v95.89,24.45 98.27,26.83 103.19,26.83 U$1.8 | v84.77,23.5 83.66,22.38 82.87,22.38 81.92,23.34 81.92,23.97 81.28,24.61 77.79,24.61 76.83,23.65 76.83,17.14 73.18,13.49 TEENSY.9
PWM3
  Bottom 0.254: U$1.5 103.19,23.02 91.6,23.02 87.47,18.89 87.47,18.41 83.5,14.45 81.76,14.45 80.8,13.49 TEENSY.6
PWM4
  Bottom 0.254: U$1.6 103.19,24.29 97.95,24.29 97.31,23.65 91.6,23.65 87,19.05 87,18.57 83.34,14.92 79.69,14.92 78.26,13.49 TEENSY.7
PWM5  (via drill 0.38)
  Top 0.254: v99.06,21.75 97.47,20.16 v91.44,20.16
  Bottom 0.254: v99.06,21.75 103.19,21.75 U$1.4 | v91.44,20.16 91.44,19.05 85.88,13.49 TEENSY.4
PWM6  (via drill 0.38)
  Top 0.254: v101.12,20.48 100.01,19.37 v89.38,19.37
  Bottom 0.254: v101.12,20.48 103.19,20.48 U$1.3 | v89.38,19.37 83.34,13.34 TEENSY.5
PWM7  (via drill 0.38)
  Top 0.254: v101.28,17.94 100.97,17.62 v93.34,17.62
  Bottom 0.254: v101.28,17.94 103.19,17.94 U$1.1 | v93.34,17.62 93.34,15.88 90.96,13.49 TEENSY.2
PWM8  (via drill 0.38)
  Top 0.254: v99.85,12.22 89.53,12.22 88.42,13.34 TEENSY.3
  Bottom 0.254: v99.85,12.22 99.85,17.46 101.6,19.21 103.19,19.21 U$1.2
PWM9  (via drill 0.38)
  Top 0.254: v24.13,17.46 23.81,17.14 v21.91,17.14 | v59.37,16.83 59.69,17.14 66.52,17.14 v67.63,18.26 | v71.28,23.34 71.6,23.65 72.23,23.65 75.56,26.99 75.56,28.57 TEENSY.17
  Bottom 0.254: v24.13,17.46 24.13,17.3 25.56,15.88 27.62,15.88 28.73,16.99 28.73,17.94 U$2.7 | v21.91,17.14 21.91,16.19 27.62,10.48 30.96,10.48 33.18,8.26 34.61,8.26 37.78,11.43 42.23,11.43 42.7,10.95 53.82,10.95 53.98,11.11 57.15,11.11 59.37,13.34 v59.37,16.83 | v67.63,18.26 71.28,21.91 v71.28,23.34
PWM10  (via drill 0.38)
  Top 0.254: v27.46,16.67 27.15,16.35 v22.7,16.35 | v33.34,9.05 36.83,5.56 43.81,5.56 47.62,9.37 v50.01,9.37 | v52.23,9.37 53.18,10.32 v54.13,10.32 | v59.21,5.24 v56.99,7.46
  Bottom 0.254: v27.46,16.67 27.46,17.94 U$2.8 | v22.7,16.35 23.02,16.35 28.42,10.95 31.43,10.95 v33.34,9.05 | v52.23,9.37 v50.01,9.37 | v56.99,7.46 v54.13,10.32 | v59.21,5.24 59.21,2.06 60.48,0.79 66.2,0.79 68.9,3.49 68.9,11.75 70.48,13.34 TEENSY.10
PWM11  (via drill 0.38)
  Top 0.254: v30,19.37 30.32,19.68 v31.59,19.68 | v31.59,21.75 30.16,23.18 21.59,23.18 21.27,23.5 11.75,23.5 7.78,19.53 7.78,15.88 8.1,15.88 11.91,12.06 v20.8,12.06 | v56.2,4.45 56.2,8.73 v62.23,8.73 | v72.07,24.45 73.66,26.04 73.66,28.57 73.18,28.57 TEENSY.16
  Bottom 0.254: v30,19.37 30,18.1 U$2.6 | v31.59,21.75 v31.59,19.68 | v20.8,12.06 27.3,5.56 30.48,5.56 31.11,6.19 36.2,6.19 41.12,1.27 53.02,1.27 v56.2,4.45 | v62.23,8.73 64.93,8.73 69.53,13.34 69.53,15.72 72.07,18.26 v72.07,24.45
PWM12  (via drill 0.38)
  Top 0.254: v23.34,18.26 23.02,17.94 21.27,17.94 v19.68,16.35 | v19.68,13.34 20,13.65 38.73,13.65 39.69,14.61 48.1,14.61 48.42,14.29 49.69,14.29 50.16,14.76 53.5,14.76 54.29,15.56 65.09,15.56 v65.88,16.35 | v68.9,23.34 68.9,23.65 68.1,24.45 68.1,28.57 TEENSY.14
  Bottom 0.254: v23.34,18.26 25.24,20.16 30.16,20.16 31.27,19.05 31.27,18.1 U$2.5 | v19.68,13.34 v19.68,16.35 | v65.88,16.35 65.88,17.46 68.26,19.84 68.26,22.7 v68.9,23.34
PWM13  (via drill 0.38)
  Top 0.254: v34.45,16.51 34.61,16.67 36.35,16.67 36.99,16.03 42.07,16.03 v42.39,16.35
  Bottom 0.254: v34.45,16.51 33.81,16.51 32.7,17.62 32.7,17.94 U$2.4 | v42.39,16.35 45.24,13.49 TEENSY.30
PWM14
  Bottom 0.254: U$2.3 33.81,18.1 33.81,19.21 33.02,20 33.02,21.27 31.11,23.18 25.72,23.18 21.75,19.21 21.75,18.26 26.51,13.49 38.58,13.49 42.23,17.14 43.97,17.14 47.62,13.49 TEENSY.29
PWM15  (via drill 0.38)
  Top 0.254: v38.73,23.81 41.91,26.99 48.26,26.99 48.74,27.46 51.44,27.46 52.55,28.57 52.7,28.57 TEENSY.38
  Bottom 0.254: v38.73,23.81 36.99,23.81 35.24,22.07 35.24,18.1 U$2.2
PWM16  (via drill 0.38)
  Top 0.254: v36.35,22.23 31.27,27.3 v24.13,27.3 | v24.13,29.37 24.45,29.69 49.21,29.69 50.16,28.73 TEENSY.37
  Bottom 0.254: v36.35,22.23 36.35,18.1 U$2.1 | v24.13,29.37 v24.13,27.3
PWM_1  (via drill 0.38)
  Top 0.254: v27.15,37.15 26.83,37.47 16.99,37.47 v16.51,37.94
  Bottom 0.254: v27.15,37.15 27.15,35.24 RN2.9 | v16.51,37.94 10.95,43.5 STRIP1.5
PWM_2  (via drill 0.38)
  Top 0.254: v28.42,36.83 27.3,37.94 17.46,37.94 v16.35,39.05
  Bottom 0.254: v28.42,36.83 28.42,35.24 RN2.10 | v16.35,39.05 12.22,43.18 12.22,45.24 11.11,46.35 STRIP1.6
PWM_3  (via drill 0.38)
  Top 0.254: v38.26,37.94 39.21,38.89 v42.7,38.89
  Bottom 0.254: v38.26,37.94 37.94,38.26 32.23,38.26 29.84,35.88 29.84,35.24 RN2.11 | v42.7,38.89 42.39,38.89 38.42,42.86 38.42,44.13 37.62,44.93 33.34,44.93 32.07,43.66 STRIP2.5
PWM_4
  Bottom 0.254: RN2.12 30.96,35.08 30.96,34.45 30.16,33.66 26.83,33.66 22.7,37.78 22.7,40.64 21.91,41.43 21.91,43.34 26.35,47.78 30.64,47.78 31.91,46.51 STRIP2.6
PWM_5  (via drill 0.38)
  Top 0.254: v36.83,37.47 38.73,39.37 42.23,39.37 43.18,40.32 v49.69,40.32
  Bottom 0.254: v36.83,37.47 36.51,37.78 33.5,37.78 32.38,36.67 32.38,35.24 RN2.13 | v49.69,40.32 52.86,43.5 STRIP3.5
PWM_6  (via drill 0.38)
  Top 0.254: v33.66,36.99 36.51,39.85 41.75,39.85 v42.07,40.16
  Bottom 0.254: v33.66,36.99 33.66,35.24 RN2.14 | v42.07,40.16 42.07,44.13 45.72,47.78 51.59,47.78 52.86,46.51 STRIP3.6
PWM_7  (via drill 0.38)
  Top 0.254: v34.77,36.83 34.13,36.2 33.5,36.2 32.86,36.83 32.86,40.32 40.64,40.32 v41.27,40.96 | v54.29,47.47 54.61,47.78 56.04,47.78 56.2,47.62 62.87,47.62 68.26,42.23 72.71,42.23 73.98,43.5 STRIP4.5
  Bottom 0.254: v34.77,36.83 34.77,35.24 RN2.15 | v41.27,40.96 41.27,43.97 45.56,48.26 53.5,48.26 v54.29,47.47
PWM_8  (via drill 0.38)
  Top 0.254: v37.15,36.2 36.67,35.72 31.11,35.72 29.05,37.78 29.05,41.27 37.78,41.27 v39.37,42.86 | v45.56,49.21 46.04,49.69 v70.8,49.69
  Bottom 0.254: v37.15,36.2 36.2,35.24 RN2.16 | v39.37,42.86 45.56,49.05 v45.56,49.21 | v70.8,49.69 73.98,46.51 STRIP4.6
PWM_9  (via drill 0.38)
  Top 0.254: v113.67,33.81 105.41,33.81 104.78,34.45 v104.78,36.67 | v104.78,39.69 103.5,40.96 v97.31,40.96
  Bottom 0.254: v113.67,33.81 120.49,26.99 RN1.9 | v104.78,39.69 v104.78,36.67 | v97.31,40.96 97.31,41.27 95.09,43.5 STRIP5.5
PWM_10  (via drill 0.38)
  Top 0.254: v115.41,36.99 v115.41,35.08 | v111.28,41.12 110.97,41.43 107.95,41.43 104.46,44.93 96.52,44.93 95.09,46.35 STRIP5.6
  Bottom 0.254: v115.41,35.08 115.41,34.61 122.08,27.94 122.08,26.51 121.28,25.72 120.65,25.72 RN1.10 | v111.28,41.12 v115.41,36.99
PWM_11  (via drill 0.38)
  Top 0.254: v126.05,26.83 v124.46,25.24 | v126.05,40.48 124.94,41.59 117.95,41.59 116.05,43.5 STRIP6.5
  Bottom 0.254: v124.46,25.24 122.4,23.18 120.65,23.18 RN1.12 | v126.05,40.48 v126.05,26.83
PWM_12  (via drill 0.38)
  Top 0.254: v122.4,24.45 125.25,27.3 v125.25,27.62
  Bottom 0.254: v122.4,24.45 120.65,24.45 RN1.11 | v125.25,27.62 125.25,37.62 119.86,43.02 119.86,44.13 119.06,44.93 117.47,44.93 116.05,46.35 STRIP6.6
PWM_13  (via drill 0.38)
  Top 0.254: v117.16,21.75 115.25,19.84 104.14,19.84 101.12,16.83 91.76,16.83 91.28,16.35 v68.58,16.35 | v61.91,10.64 54.77,10.64 54.29,11.11 52.7,11.11 50.01,8.41 50.01,7.62 S1.A
  Bottom 0.254: v117.16,21.75 120.49,21.75 RN1.13 | v68.58,16.35 66.99,16.35 64.14,13.49 64.14,12.86 v61.91,10.64
PWM_14  (via drill 0.38)
  Top 0.254: v118.11,20.48 118.11,17.94 v106.05,17.94 | v98.9,7.14 97.31,8.73 64.14,8.73 63.02,7.62 S2.A
  Bottom 0.254: v118.11,20.48 120.49,20.48 RN1.14 | v106.05,17.94 102.23,14.13 102.23,10.48 v98.9,7.14
PWM_15  (via drill 0.38)
  Top 0.254: v123.35,19.37 126.84,22.86 134.14,22.86 134.78,22.23 134.78,13.02 120.65,13.02 120.49,13.18 114.46,13.18 111.76,10.48 v78.9,10.48
  Bottom 0.254: v123.35,19.37 120.65,19.37 RN1.15 | v78.9,10.48 76.04,7.62 S3.A
PWM_16  (via drill 0.38)
  Top 0.254: v106.2,19.05 v117.16,19.05 | v90.17,3.65 90.17,4.13 89.06,5.24 89.06,7.46 S4.A
  Bottom 0.254: v117.16,19.05 118.11,18.1 120.49,18.1 RN1.16 | v106.2,19.05 101.76,14.61 101.76,10.95 92.08,1.27 91.12,1.27 90.17,2.22 v90.17,3.65
S1  (via drill 0.38)
  Top 0.254: TEENSY.33 40.01,28.57 v13.34,28.57 13.02,28.57 11.11,30.48 J4.5
  Bottom 0.254: v13.34,28.57 13.34,26.99 5.4,19.05 J1.3
S2  (via drill 0.38)
  Top 0.254: v23.97,35.24 23.65,35.56 16.99,35.56 16.19,34.77 12.38,34.77 11.11,33.5 J4.6
  Bottom 0.254: v23.97,35.24 26.04,33.18 37.15,33.18 41.59,28.73 42.55,28.73 TEENSY.34 | J2.3 2.86,19.05 2.86,19.68 1.59,20.95 1.59,24.45 7.14,30 7.14,31.11 8.1,32.07 9.68,32.07 10.95,33.34 J4.6
V+  (via drill 0.38)
  Top 0.254: v26.35,19.37 27.46,18.26 49.05,18.26 v49.37,18.57 | v61.75,24.13 63.66,22.23 68.42,22.23 68.58,22.07 v73.18,22.07 | v73.18,23.65 76.83,27.3 81.28,27.3 82.07,28.1 82.07,31.43 v87.79,31.43 | v90.49,34.13 97,34.13 v101.76,29.37
  Bottom 0.254: v26.35,19.37 26.35,18.1 U$2.9 | v49.37,18.57 51.75,20.95 51.75,21.43 52.7,22.38 53.18,22.38 54.29,23.5 54.29,23.97 54.93,24.61 61.28,24.61 v61.75,24.13 | v73.18,23.65 v73.18,22.07 | v90.49,34.13 v87.79,31.43 | v101.76,29.37 102.87,28.26 103.19,28.26 U$1.9

## Text on the board
tPlace: MOL v2-2 | 2017 Ali Momeni / Made in PGH